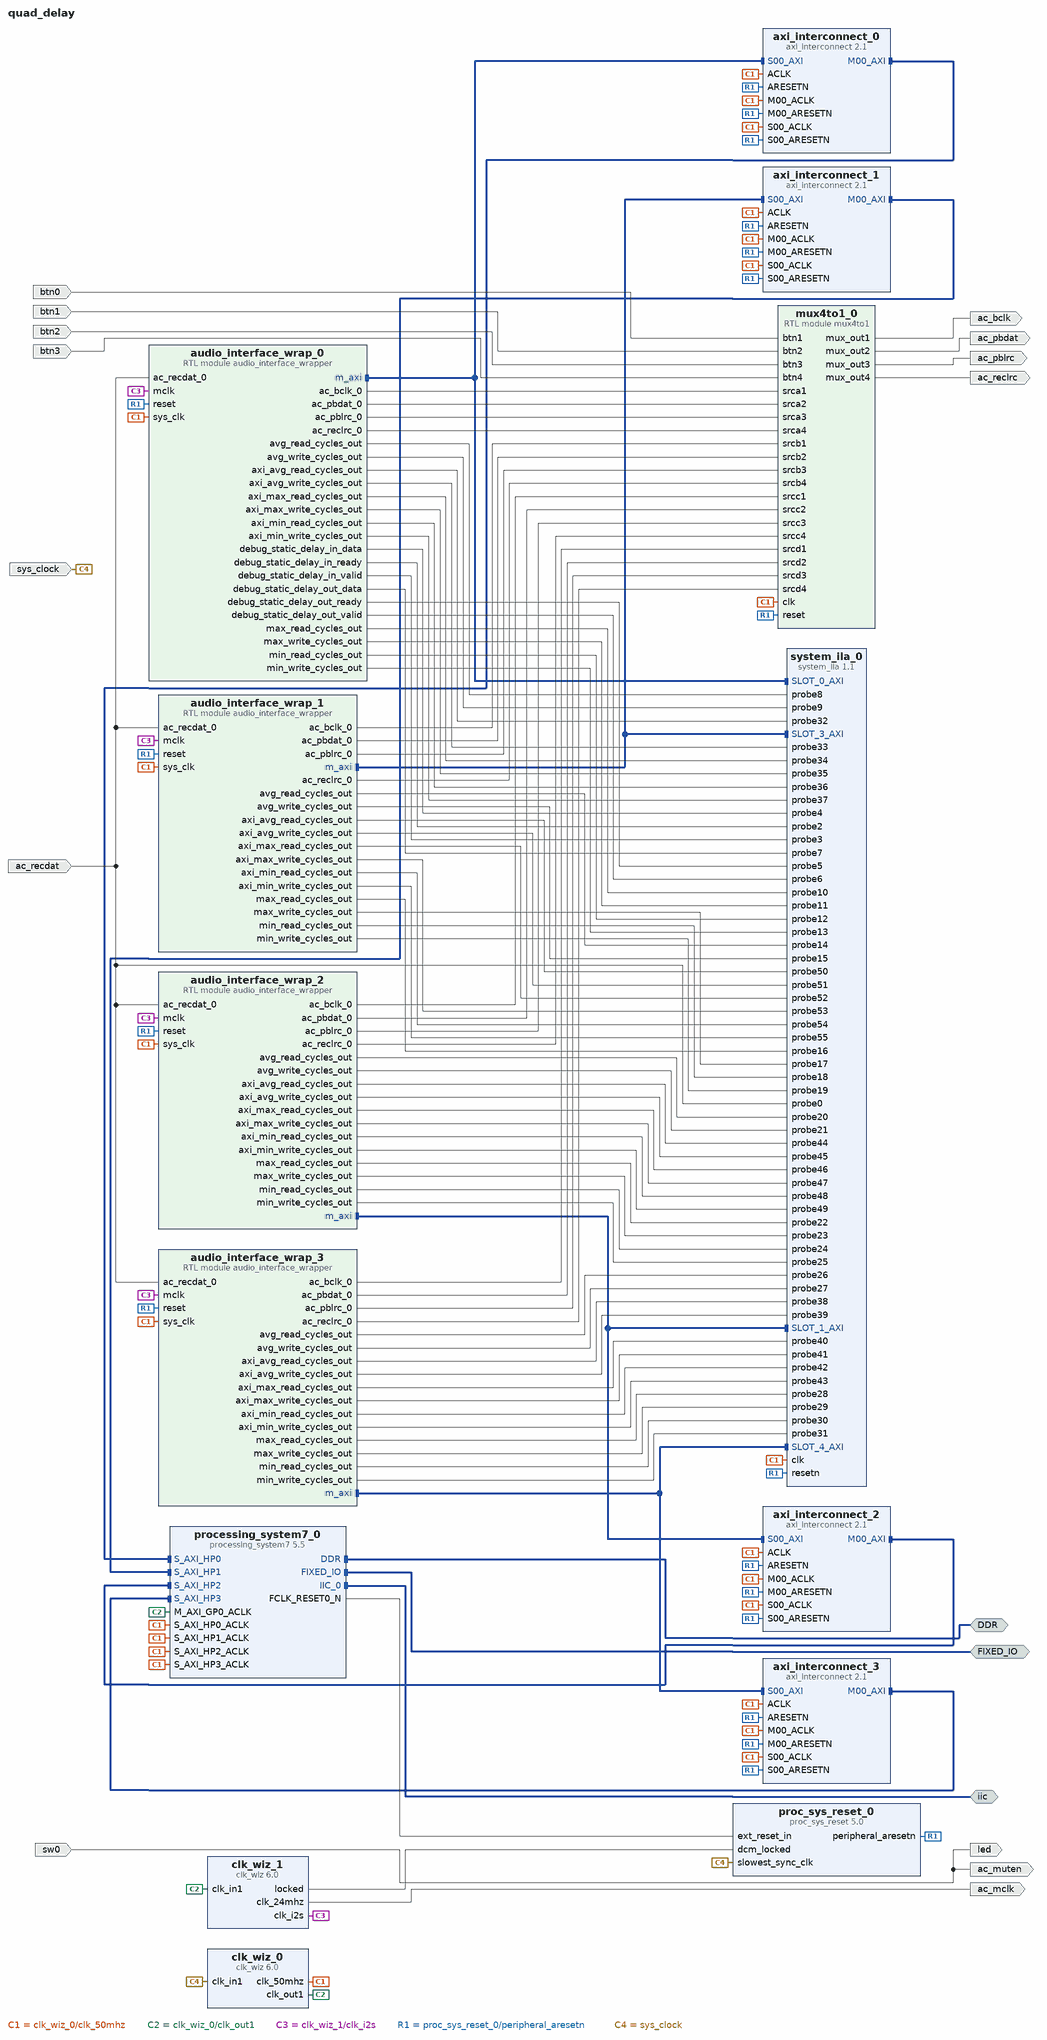
[diagram p0: block diagram of the top level]
# Vivado block design quad_delay, xc7z020clg400-1, Vivado 2022.2
create_bd_design quad_delay

create_bd_intf_port -mode Master -vlnv xilinx.com:interface:ddrx_rtl:1.0 DDR
create_bd_intf_port -mode Master -vlnv xilinx.com:display_processing_system7:fixedio_rtl:1.0 FIXED_IO
create_bd_intf_port -mode Master -vlnv xilinx.com:interface:iic_rtl:1.0 iic
create_bd_port -dir O ac_bclk
create_bd_port -dir O -type clk ac_mclk
create_bd_port -dir O ac_muten
create_bd_port -dir O ac_pbdat
create_bd_port -dir O ac_pblrc
create_bd_port -dir I ac_recdat
create_bd_port -dir O ac_reclrc
create_bd_port -dir I btn0
create_bd_port -dir I btn1
create_bd_port -dir I btn2
create_bd_port -dir I btn3
create_bd_port -dir O led
create_bd_port -dir I sw0
create_bd_port -dir I sys_clock

create_bd_cell -type ip -vlnv xilinx.com:ip:axi_interconnect:2.1 axi_interconnect_0
set_property -dict {CONFIG.NUM_MI 1} [get_bd_cells axi_interconnect_0]
create_bd_cell -type ip -vlnv xilinx.com:ip:axi_interconnect:2.1 axi_interconnect_1
set_property -dict {CONFIG.NUM_MI 1} [get_bd_cells axi_interconnect_1]
create_bd_cell -type ip -vlnv xilinx.com:ip:axi_interconnect:2.1 axi_interconnect_2
set_property -dict {CONFIG.NUM_MI 1} [get_bd_cells axi_interconnect_2]
create_bd_cell -type ip -vlnv xilinx.com:ip:clk_wiz:6.0 clk_wiz_0
set_property -dict [list \
  CONFIG.CLKOUT1_JITTER 161.803 \
  CONFIG.CLKOUT1_PHASE_ERROR 160.491 \
  CONFIG.CLKOUT1_REQUESTED_OUT_FREQ 122.885835 \
  CONFIG.CLKOUT2_JITTER 197.162 \
  CONFIG.CLKOUT2_PHASE_ERROR 160.491 \
  CONFIG.CLKOUT2_REQUESTED_OUT_FREQ 50 \
  CONFIG.CLKOUT2_USED true \
  CONFIG.CLK_OUT2_PORT clk_50mhz \
  CONFIG.MMCM_CLKFBOUT_MULT_F 18.125 \
  CONFIG.MMCM_CLKOUT0_DIVIDE_F 7.375 \
  CONFIG.MMCM_CLKOUT1_DIVIDE 18 \
  CONFIG.MMCM_DIVCLK_DIVIDE 2 \
  CONFIG.NUM_OUT_CLKS 2 \
  CONFIG.USE_LOCKED false \
  CONFIG.USE_RESET false \
] [get_bd_cells clk_wiz_0]
create_bd_cell -type ip -vlnv xilinx.com:ip:clk_wiz:6.0 clk_wiz_1
set_property -dict [list \
  CONFIG.CLKOUT1_JITTER 325.784 \
  CONFIG.CLKOUT1_PHASE_ERROR 288.212 \
  CONFIG.CLKOUT1_REQUESTED_OUT_FREQ 12.288 \
  CONFIG.CLKOUT2_JITTER 289.085 \
  CONFIG.CLKOUT2_PHASE_ERROR 288.212 \
  CONFIG.CLKOUT2_REQUESTED_OUT_FREQ 24.576 \
  CONFIG.CLKOUT2_USED true \
  CONFIG.CLK_OUT1_PORT clk_i2s \
  CONFIG.CLK_OUT2_PORT clk_24mhz \
  CONFIG.MMCM_CLKFBOUT_MULT_F 50.375 \
  CONFIG.MMCM_CLKOUT0_DIVIDE_F 84.000 \
  CONFIG.MMCM_CLKOUT1_DIVIDE 42 \
  CONFIG.MMCM_DIVCLK_DIVIDE 6 \
  CONFIG.NUM_OUT_CLKS 2 \
  CONFIG.USE_RESET false \
] [get_bd_cells clk_wiz_1]
create_bd_cell -type module -reference mux4to1 mux4to1_0
create_bd_cell -type ip -vlnv xilinx.com:ip:proc_sys_reset:5.0 proc_sys_reset_0
create_bd_cell -type ip -vlnv xilinx.com:ip:processing_system7:5.5 processing_system7_0
set_property -dict [list \
  CONFIG.PCW_APU_PERIPHERAL_FREQMHZ 667 \
  CONFIG.PCW_ENET0_ENET0_IO {MIO 16 .. 27} \
  CONFIG.PCW_ENET0_GRP_MDIO_ENABLE 1 \
  CONFIG.PCW_ENET0_GRP_MDIO_IO {MIO 52 .. 53} \
  CONFIG.PCW_ENET0_PERIPHERAL_ENABLE 1 \
  CONFIG.PCW_ENET0_RESET_ENABLE 0 \
  CONFIG.PCW_ENET_RESET_ENABLE 1 \
  CONFIG.PCW_ENET_RESET_SELECT {Share reset pin} \
  CONFIG.PCW_FPGA0_PERIPHERAL_FREQMHZ 50 \
  CONFIG.PCW_FPGA1_PERIPHERAL_FREQMHZ 50 \
  CONFIG.PCW_GPIO_MIO_GPIO_ENABLE 1 \
  CONFIG.PCW_GPIO_MIO_GPIO_IO MIO \
  CONFIG.PCW_I2C0_I2C0_IO EMIO \
  CONFIG.PCW_I2C0_PERIPHERAL_ENABLE 1 \
  CONFIG.PCW_I2C_PERIPHERAL_FREQMHZ 111.111115 \
  CONFIG.PCW_I2C_RESET_ENABLE 1 \
  CONFIG.PCW_I2C_RESET_SELECT {Share reset pin} \
  CONFIG.PCW_PERIPHERAL_BOARD_PRESET part0 \
  CONFIG.PCW_PRESET_BANK1_VOLTAGE {LVCMOS 1.8V} \
  CONFIG.PCW_QSPI_GRP_FBCLK_ENABLE 1 \
  CONFIG.PCW_QSPI_GRP_FBCLK_IO {MIO 8} \
  CONFIG.PCW_QSPI_GRP_SINGLE_SS_ENABLE 1 \
  CONFIG.PCW_QSPI_GRP_SINGLE_SS_IO {MIO 1 .. 6} \
  CONFIG.PCW_QSPI_PERIPHERAL_ENABLE 1 \
  CONFIG.PCW_QSPI_QSPI_IO {MIO 1 .. 6} \
  CONFIG.PCW_SD0_GRP_CD_ENABLE 1 \
  CONFIG.PCW_SD0_GRP_CD_IO {MIO 47} \
  CONFIG.PCW_SD0_GRP_WP_ENABLE 0 \
  CONFIG.PCW_SD0_PERIPHERAL_ENABLE 1 \
  CONFIG.PCW_SD0_SD0_IO {MIO 40 .. 45} \
  CONFIG.PCW_SDIO_PERIPHERAL_FREQMHZ 50 \
  CONFIG.PCW_SINGLE_QSPI_DATA_MODE x4 \
  CONFIG.PCW_S_AXI_HP0_DATA_WIDTH 32 \
  CONFIG.PCW_S_AXI_HP1_DATA_WIDTH 32 \
  CONFIG.PCW_S_AXI_HP2_DATA_WIDTH 32 \
  CONFIG.PCW_S_AXI_HP3_DATA_WIDTH 32 \
  CONFIG.PCW_UART1_PERIPHERAL_ENABLE 1 \
  CONFIG.PCW_UART1_UART1_IO {MIO 48 .. 49} \
  CONFIG.PCW_UART_PERIPHERAL_FREQMHZ 100 \
  CONFIG.PCW_UIPARAM_DDR_FREQ_MHZ 533.333333 \
  CONFIG.PCW_UIPARAM_DDR_MEMORY_TYPE {DDR 3 (Low Voltage)} \
  CONFIG.PCW_UIPARAM_DDR_PARTNO {MT41K256M16 RE-125} \
  CONFIG.PCW_USB0_PERIPHERAL_ENABLE 1 \
  CONFIG.PCW_USB0_RESET_ENABLE 1 \
  CONFIG.PCW_USB0_RESET_IO {MIO 46} \
  CONFIG.PCW_USB0_USB0_IO {MIO 28 .. 39} \
  CONFIG.PCW_USB_RESET_ENABLE 1 \
  CONFIG.PCW_USB_RESET_SELECT {Share reset pin} \
  CONFIG.PCW_USE_S_AXI_HP0 1 \
  CONFIG.PCW_USE_S_AXI_HP1 1 \
  CONFIG.PCW_USE_S_AXI_HP2 1 \
  CONFIG.PCW_USE_S_AXI_HP3 1 \
] [get_bd_cells processing_system7_0]
# 500 more settings of processing_system7_0 are not shown: defaults, MIO pin electricals, DDR timing, and values the tool derives
create_bd_cell -type ip -vlnv xilinx.com:ip:system_ila:1.1 system_ila_0
set_property -dict {CONFIG.C_MON_TYPE MIX CONFIG.C_NUM_MONITOR_SLOTS 5 CONFIG.C_NUM_OF_PROBES 56} [get_bd_cells system_ila_0]
create_bd_cell -type ip -vlnv xilinx.com:ip:axi_interconnect:2.1 axi_interconnect_3
set_property -dict {CONFIG.NUM_MI 1} [get_bd_cells axi_interconnect_3]
create_bd_cell -type module -reference audio_interface_wrapper audio_interface_wrap_0
create_bd_cell -type module -reference audio_interface_wrapper audio_interface_wrap_1
set_property -dict {CONFIG.DRAM_START_ADDRESS 0x00381000} [get_bd_cells audio_interface_wrap_1]
create_bd_cell -type module -reference audio_interface_wrapper audio_interface_wrap_3
set_property -dict {CONFIG.DRAM_START_ADDRESS 0x00981000} [get_bd_cells audio_interface_wrap_3]
create_bd_cell -type module -reference audio_interface_wrapper audio_interface_wrap_2
set_property -dict {CONFIG.DRAM_START_ADDRESS 0x00681000} [get_bd_cells audio_interface_wrap_2]

# ---- connections ----

connect_bd_intf_net [get_bd_intf_pins audio_interface_wrap_0/m_axi] [get_bd_intf_pins axi_interconnect_0/S00_AXI]
connect_bd_intf_net [get_bd_intf_pins audio_interface_wrap_0/m_axi] [get_bd_intf_pins system_ila_0/SLOT_0_AXI]
connect_bd_intf_net [get_bd_intf_pins audio_interface_wrap_1/m_axi] [get_bd_intf_pins axi_interconnect_1/S00_AXI]
connect_bd_intf_net [get_bd_intf_pins audio_interface_wrap_1/m_axi] [get_bd_intf_pins system_ila_0/SLOT_3_AXI]
connect_bd_intf_net [get_bd_intf_pins audio_interface_wrap_2/m_axi] [get_bd_intf_pins axi_interconnect_2/S00_AXI]
connect_bd_intf_net [get_bd_intf_pins audio_interface_wrap_2/m_axi] [get_bd_intf_pins system_ila_0/SLOT_1_AXI]
connect_bd_intf_net [get_bd_intf_pins audio_interface_wrap_3/m_axi] [get_bd_intf_pins axi_interconnect_3/S00_AXI]
connect_bd_intf_net [get_bd_intf_pins audio_interface_wrap_3/m_axi] [get_bd_intf_pins system_ila_0/SLOT_4_AXI]
connect_bd_intf_net [get_bd_intf_pins axi_interconnect_0/M00_AXI] [get_bd_intf_pins processing_system7_0/S_AXI_HP0]
connect_bd_intf_net [get_bd_intf_pins axi_interconnect_1/M00_AXI] [get_bd_intf_pins processing_system7_0/S_AXI_HP1]
connect_bd_intf_net [get_bd_intf_pins processing_system7_0/S_AXI_HP2] [get_bd_intf_pins axi_interconnect_2/M00_AXI]
connect_bd_intf_net [get_bd_intf_pins processing_system7_0/S_AXI_HP3] [get_bd_intf_pins axi_interconnect_3/M00_AXI]
connect_bd_intf_net [get_bd_intf_ports DDR] [get_bd_intf_pins processing_system7_0/DDR]
connect_bd_intf_net [get_bd_intf_ports FIXED_IO] [get_bd_intf_pins processing_system7_0/FIXED_IO]
connect_bd_intf_net [get_bd_intf_ports iic] [get_bd_intf_pins processing_system7_0/IIC_0]
connect_bd_net [get_bd_ports ac_recdat] \
  [get_bd_pins system_ila_0/probe0] [get_bd_pins audio_interface_wrap_0/ac_recdat_0] \
  [get_bd_pins audio_interface_wrap_1/ac_recdat_0] [get_bd_pins audio_interface_wrap_3/ac_recdat_0] \
  [get_bd_pins audio_interface_wrap_2/ac_recdat_0]
connect_bd_net [get_bd_pins audio_interface_wrap_0/ac_bclk_0] [get_bd_pins mux4to1_0/srca1]
connect_bd_net [get_bd_pins audio_interface_wrap_0/ac_pbdat_0] [get_bd_pins mux4to1_0/srca2]
connect_bd_net [get_bd_pins audio_interface_wrap_0/ac_pblrc_0] [get_bd_pins mux4to1_0/srca3]
connect_bd_net [get_bd_pins audio_interface_wrap_0/ac_reclrc_0] [get_bd_pins mux4to1_0/srca4]
connect_bd_net [get_bd_pins audio_interface_wrap_0/avg_read_cycles_out] [get_bd_pins system_ila_0/probe8]
connect_bd_net [get_bd_pins audio_interface_wrap_0/avg_write_cycles_out] [get_bd_pins system_ila_0/probe9]
connect_bd_net [get_bd_pins audio_interface_wrap_0/axi_avg_read_cycles_out] [get_bd_pins system_ila_0/probe32]
connect_bd_net [get_bd_pins audio_interface_wrap_0/axi_avg_write_cycles_out] [get_bd_pins system_ila_0/probe33]
connect_bd_net [get_bd_pins audio_interface_wrap_0/axi_max_read_cycles_out] [get_bd_pins system_ila_0/probe34]
connect_bd_net [get_bd_pins audio_interface_wrap_0/axi_max_write_cycles_out] [get_bd_pins system_ila_0/probe35]
connect_bd_net [get_bd_pins audio_interface_wrap_0/axi_min_read_cycles_out] [get_bd_pins system_ila_0/probe36]
connect_bd_net [get_bd_pins audio_interface_wrap_0/axi_min_write_cycles_out] [get_bd_pins system_ila_0/probe37]
connect_bd_net [get_bd_pins audio_interface_wrap_0/debug_static_delay_in_data] [get_bd_pins system_ila_0/probe4]
connect_bd_net [get_bd_pins audio_interface_wrap_0/debug_static_delay_in_ready] [get_bd_pins system_ila_0/probe2]
connect_bd_net [get_bd_pins audio_interface_wrap_0/debug_static_delay_in_valid] [get_bd_pins system_ila_0/probe3]
connect_bd_net [get_bd_pins audio_interface_wrap_0/debug_static_delay_out_data] [get_bd_pins system_ila_0/probe7]
connect_bd_net [get_bd_pins audio_interface_wrap_0/debug_static_delay_out_ready] [get_bd_pins system_ila_0/probe5]
connect_bd_net [get_bd_pins audio_interface_wrap_0/debug_static_delay_out_valid] [get_bd_pins system_ila_0/probe6]
connect_bd_net [get_bd_pins audio_interface_wrap_0/max_read_cycles_out] [get_bd_pins system_ila_0/probe10]
connect_bd_net [get_bd_pins audio_interface_wrap_0/max_write_cycles_out] [get_bd_pins system_ila_0/probe11]
connect_bd_net [get_bd_pins audio_interface_wrap_0/min_read_cycles_out] [get_bd_pins system_ila_0/probe12]
connect_bd_net [get_bd_pins audio_interface_wrap_0/min_write_cycles_out] [get_bd_pins system_ila_0/probe13]
connect_bd_net [get_bd_pins audio_interface_wrap_1/ac_bclk_0] [get_bd_pins mux4to1_0/srcb1]
connect_bd_net [get_bd_pins audio_interface_wrap_1/ac_pbdat_0] [get_bd_pins mux4to1_0/srcb2]
connect_bd_net [get_bd_pins audio_interface_wrap_1/ac_pblrc_0] [get_bd_pins mux4to1_0/srcb3]
connect_bd_net [get_bd_pins audio_interface_wrap_1/ac_reclrc_0] [get_bd_pins mux4to1_0/srcb4]
connect_bd_net [get_bd_pins audio_interface_wrap_1/avg_read_cycles_out] [get_bd_pins system_ila_0/probe14]
connect_bd_net [get_bd_pins audio_interface_wrap_1/avg_write_cycles_out] [get_bd_pins system_ila_0/probe15]
connect_bd_net [get_bd_pins audio_interface_wrap_1/axi_avg_read_cycles_out] [get_bd_pins system_ila_0/probe50]
connect_bd_net [get_bd_pins audio_interface_wrap_1/axi_avg_write_cycles_out] [get_bd_pins system_ila_0/probe51]
connect_bd_net [get_bd_pins audio_interface_wrap_1/axi_max_read_cycles_out] [get_bd_pins system_ila_0/probe52]
connect_bd_net [get_bd_pins audio_interface_wrap_1/axi_max_write_cycles_out] [get_bd_pins system_ila_0/probe53]
connect_bd_net [get_bd_pins audio_interface_wrap_1/axi_min_read_cycles_out] [get_bd_pins system_ila_0/probe54]
connect_bd_net [get_bd_pins audio_interface_wrap_1/axi_min_write_cycles_out] [get_bd_pins system_ila_0/probe55]
connect_bd_net [get_bd_pins audio_interface_wrap_1/max_read_cycles_out] [get_bd_pins system_ila_0/probe16]
connect_bd_net [get_bd_pins audio_interface_wrap_1/max_write_cycles_out] [get_bd_pins system_ila_0/probe17]
connect_bd_net [get_bd_pins audio_interface_wrap_1/min_read_cycles_out] [get_bd_pins system_ila_0/probe18]
connect_bd_net [get_bd_pins audio_interface_wrap_1/min_write_cycles_out] [get_bd_pins system_ila_0/probe19]
connect_bd_net [get_bd_pins audio_interface_wrap_2/ac_bclk_0] [get_bd_pins mux4to1_0/srcc1]
connect_bd_net [get_bd_pins audio_interface_wrap_2/ac_pbdat_0] [get_bd_pins mux4to1_0/srcc2]
connect_bd_net [get_bd_pins audio_interface_wrap_2/ac_pblrc_0] [get_bd_pins mux4to1_0/srcc3]
connect_bd_net [get_bd_pins audio_interface_wrap_2/ac_reclrc_0] [get_bd_pins mux4to1_0/srcc4]
connect_bd_net [get_bd_pins audio_interface_wrap_2/avg_read_cycles_out] [get_bd_pins system_ila_0/probe20]
connect_bd_net [get_bd_pins audio_interface_wrap_2/avg_write_cycles_out] [get_bd_pins system_ila_0/probe21]
connect_bd_net [get_bd_pins audio_interface_wrap_2/axi_avg_read_cycles_out] [get_bd_pins system_ila_0/probe44]
connect_bd_net [get_bd_pins audio_interface_wrap_2/axi_avg_write_cycles_out] [get_bd_pins system_ila_0/probe45]
connect_bd_net [get_bd_pins audio_interface_wrap_2/axi_max_read_cycles_out] [get_bd_pins system_ila_0/probe46]
connect_bd_net [get_bd_pins audio_interface_wrap_2/axi_max_write_cycles_out] [get_bd_pins system_ila_0/probe47]
connect_bd_net [get_bd_pins audio_interface_wrap_2/axi_min_read_cycles_out] [get_bd_pins system_ila_0/probe48]
connect_bd_net [get_bd_pins audio_interface_wrap_2/axi_min_write_cycles_out] [get_bd_pins system_ila_0/probe49]
connect_bd_net [get_bd_pins audio_interface_wrap_2/max_read_cycles_out] [get_bd_pins system_ila_0/probe22]
connect_bd_net [get_bd_pins audio_interface_wrap_2/max_write_cycles_out] [get_bd_pins system_ila_0/probe23]
connect_bd_net [get_bd_pins audio_interface_wrap_2/min_read_cycles_out] [get_bd_pins system_ila_0/probe24]
connect_bd_net [get_bd_pins audio_interface_wrap_2/min_write_cycles_out] [get_bd_pins system_ila_0/probe25]
connect_bd_net [get_bd_pins audio_interface_wrap_3/ac_bclk_0] [get_bd_pins mux4to1_0/srcd1]
connect_bd_net [get_bd_pins audio_interface_wrap_3/ac_pbdat_0] [get_bd_pins mux4to1_0/srcd2]
connect_bd_net [get_bd_pins audio_interface_wrap_3/ac_pblrc_0] [get_bd_pins mux4to1_0/srcd3]
connect_bd_net [get_bd_pins audio_interface_wrap_3/ac_reclrc_0] [get_bd_pins mux4to1_0/srcd4]
connect_bd_net [get_bd_pins audio_interface_wrap_3/avg_read_cycles_out] [get_bd_pins system_ila_0/probe26]
connect_bd_net [get_bd_pins audio_interface_wrap_3/avg_write_cycles_out] [get_bd_pins system_ila_0/probe27]
connect_bd_net [get_bd_pins audio_interface_wrap_3/axi_avg_read_cycles_out] [get_bd_pins system_ila_0/probe38]
connect_bd_net [get_bd_pins audio_interface_wrap_3/axi_avg_write_cycles_out] [get_bd_pins system_ila_0/probe39]
connect_bd_net [get_bd_pins audio_interface_wrap_3/axi_max_read_cycles_out] [get_bd_pins system_ila_0/probe40]
connect_bd_net [get_bd_pins audio_interface_wrap_3/axi_max_write_cycles_out] [get_bd_pins system_ila_0/probe41]
connect_bd_net [get_bd_pins audio_interface_wrap_3/axi_min_read_cycles_out] [get_bd_pins system_ila_0/probe42]
connect_bd_net [get_bd_pins audio_interface_wrap_3/axi_min_write_cycles_out] [get_bd_pins system_ila_0/probe43]
connect_bd_net [get_bd_pins audio_interface_wrap_3/max_read_cycles_out] [get_bd_pins system_ila_0/probe28]
connect_bd_net [get_bd_pins audio_interface_wrap_3/max_write_cycles_out] [get_bd_pins system_ila_0/probe29]
connect_bd_net [get_bd_pins audio_interface_wrap_3/min_read_cycles_out] [get_bd_pins system_ila_0/probe30]
connect_bd_net [get_bd_pins audio_interface_wrap_3/min_write_cycles_out] [get_bd_pins system_ila_0/probe31]
connect_bd_net -net btn0_1 [get_bd_ports btn0] [get_bd_pins mux4to1_0/btn1]
connect_bd_net -net btn1_1 [get_bd_ports btn1] [get_bd_pins mux4to1_0/btn2]
connect_bd_net -net btn2_1 [get_bd_ports btn2] [get_bd_pins mux4to1_0/btn3]
connect_bd_net -net btn3_1 [get_bd_ports btn3] [get_bd_pins mux4to1_0/btn4]
connect_bd_net [get_bd_pins clk_wiz_0/clk_50mhz] \
  [get_bd_pins processing_system7_0/S_AXI_HP0_ACLK] [get_bd_pins axi_interconnect_0/ACLK] \
  [get_bd_pins axi_interconnect_0/S00_ACLK] [get_bd_pins axi_interconnect_0/M00_ACLK] [get_bd_pins system_ila_0/clk] \
  [get_bd_pins axi_interconnect_1/ACLK] [get_bd_pins axi_interconnect_1/S00_ACLK] [get_bd_pins axi_interconnect_1/M00_ACLK] \
  [get_bd_pins processing_system7_0/S_AXI_HP1_ACLK] [get_bd_pins mux4to1_0/clk] [get_bd_pins axi_interconnect_2/S00_ACLK] \
  [get_bd_pins axi_interconnect_2/ACLK] [get_bd_pins axi_interconnect_2/M00_ACLK] \
  [get_bd_pins processing_system7_0/S_AXI_HP2_ACLK] [get_bd_pins axi_interconnect_3/ACLK] \
  [get_bd_pins axi_interconnect_3/S00_ACLK] [get_bd_pins axi_interconnect_3/M00_ACLK] \
  [get_bd_pins processing_system7_0/S_AXI_HP3_ACLK] [get_bd_pins audio_interface_wrap_0/sys_clk] \
  [get_bd_pins audio_interface_wrap_1/sys_clk] [get_bd_pins audio_interface_wrap_3/sys_clk] \
  [get_bd_pins audio_interface_wrap_2/sys_clk]
connect_bd_net [get_bd_pins clk_wiz_0/clk_out1] [get_bd_pins processing_system7_0/M_AXI_GP0_ACLK] [get_bd_pins clk_wiz_1/clk_in1]
connect_bd_net [get_bd_pins clk_wiz_1/clk_24mhz] [get_bd_ports ac_mclk]
connect_bd_net [get_bd_pins clk_wiz_1/clk_i2s] \
  [get_bd_pins audio_interface_wrap_0/mclk] [get_bd_pins audio_interface_wrap_1/mclk] \
  [get_bd_pins audio_interface_wrap_3/mclk] [get_bd_pins audio_interface_wrap_2/mclk]
connect_bd_net [get_bd_pins clk_wiz_1/locked] [get_bd_pins proc_sys_reset_0/dcm_locked]
connect_bd_net [get_bd_pins mux4to1_0/mux_out1] [get_bd_ports ac_bclk]
connect_bd_net [get_bd_pins mux4to1_0/mux_out2] [get_bd_ports ac_pbdat]
connect_bd_net [get_bd_pins mux4to1_0/mux_out3] [get_bd_ports ac_pblrc]
connect_bd_net [get_bd_pins mux4to1_0/mux_out4] [get_bd_ports ac_reclrc]
connect_bd_net [get_bd_pins proc_sys_reset_0/peripheral_aresetn] \
  [get_bd_pins axi_interconnect_0/M00_ARESETN] [get_bd_pins axi_interconnect_0/ARESETN] \
  [get_bd_pins axi_interconnect_0/S00_ARESETN] [get_bd_pins system_ila_0/resetn] [get_bd_pins mux4to1_0/reset] \
  [get_bd_pins axi_interconnect_1/ARESETN] [get_bd_pins axi_interconnect_1/S00_ARESETN] \
  [get_bd_pins axi_interconnect_1/M00_ARESETN] [get_bd_pins axi_interconnect_2/M00_ARESETN] \
  [get_bd_pins axi_interconnect_2/ARESETN] [get_bd_pins axi_interconnect_2/S00_ARESETN] \
  [get_bd_pins axi_interconnect_3/ARESETN] [get_bd_pins axi_interconnect_3/S00_ARESETN] \
  [get_bd_pins axi_interconnect_3/M00_ARESETN] [get_bd_pins audio_interface_wrap_0/reset] \
  [get_bd_pins audio_interface_wrap_1/reset] [get_bd_pins audio_interface_wrap_3/reset] \
  [get_bd_pins audio_interface_wrap_2/reset]
connect_bd_net [get_bd_pins processing_system7_0/FCLK_RESET0_N] [get_bd_pins proc_sys_reset_0/ext_reset_in]
connect_bd_net -net sw0_1 [get_bd_ports sw0] [get_bd_ports ac_muten] [get_bd_ports led]
connect_bd_net [get_bd_ports sys_clock] [get_bd_pins clk_wiz_0/clk_in1] [get_bd_pins proc_sys_reset_0/slowest_sync_clk]

# ---- address map ----
assign_bd_address -offset 0x00000000 -range 1G -target_address_space [get_bd_addr_spaces audio_interface_wrap_0/m_axi] [get_bd_addr_segs processing_system7_0/S_AXI_HP0/HP0_DDR_LOWOCM]
assign_bd_address -offset 0x00000000 -range 1G -target_address_space [get_bd_addr_spaces audio_interface_wrap_1/m_axi] [get_bd_addr_segs processing_system7_0/S_AXI_HP1/HP1_DDR_LOWOCM]

validate_bd_design
save_bd_design
